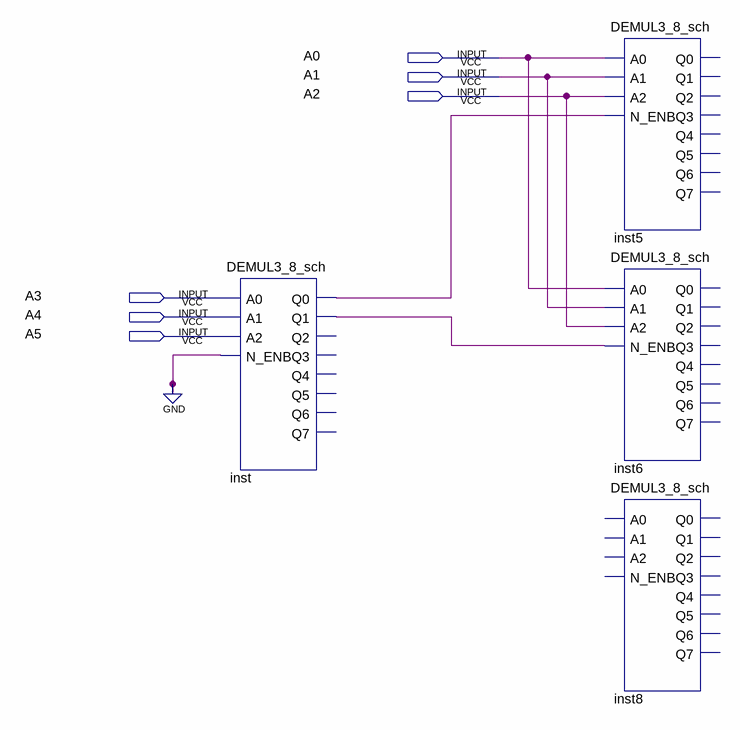
[diagram p0: schematic sheet]
// Quartus schematic DEMUL6_64_sch.bdf as structural Verilog: 4 symbols, 6 pins
module DEMUL6_64_sch (
  input  A0,
  input  A1,
  input  A2,
  input  A3,
  input  A4,
  input  A5
);

  wire inst_q0, inst_q1;

  DEMUL3_8_sch inst (
    .A0(A3), .A1(A4), .A2(A5), .N_ENB(1'b0), .Q0(inst_q0), .Q1(inst_q1));  // open: Q2, Q3, Q4, Q5, Q6, Q7
  DEMUL3_8_sch inst5 (.A0(A0), .A1(A1), .A2(A2), .N_ENB(inst_q0));  // open: Q0, Q1, Q2, Q3, Q4, Q5, Q6, Q7
  DEMUL3_8_sch inst6 (.A0(A0), .A1(A1), .A2(A2), .N_ENB(inst_q1));  // open: Q0, Q1, Q2, Q3, Q4, Q5, Q6, Q7
  DEMUL3_8_sch inst8 ();  // open: A0, A1, A2, N_ENB, Q0, Q1, Q2, Q3, Q4, Q5, Q6, Q7
endmodule
